# Altium schematic sheet Arria10_Ground.SchDoc: Arria 10 Ground Connections
size B; DocumentNumber: 29; SheetNumber: 29; SheetTotal: 46
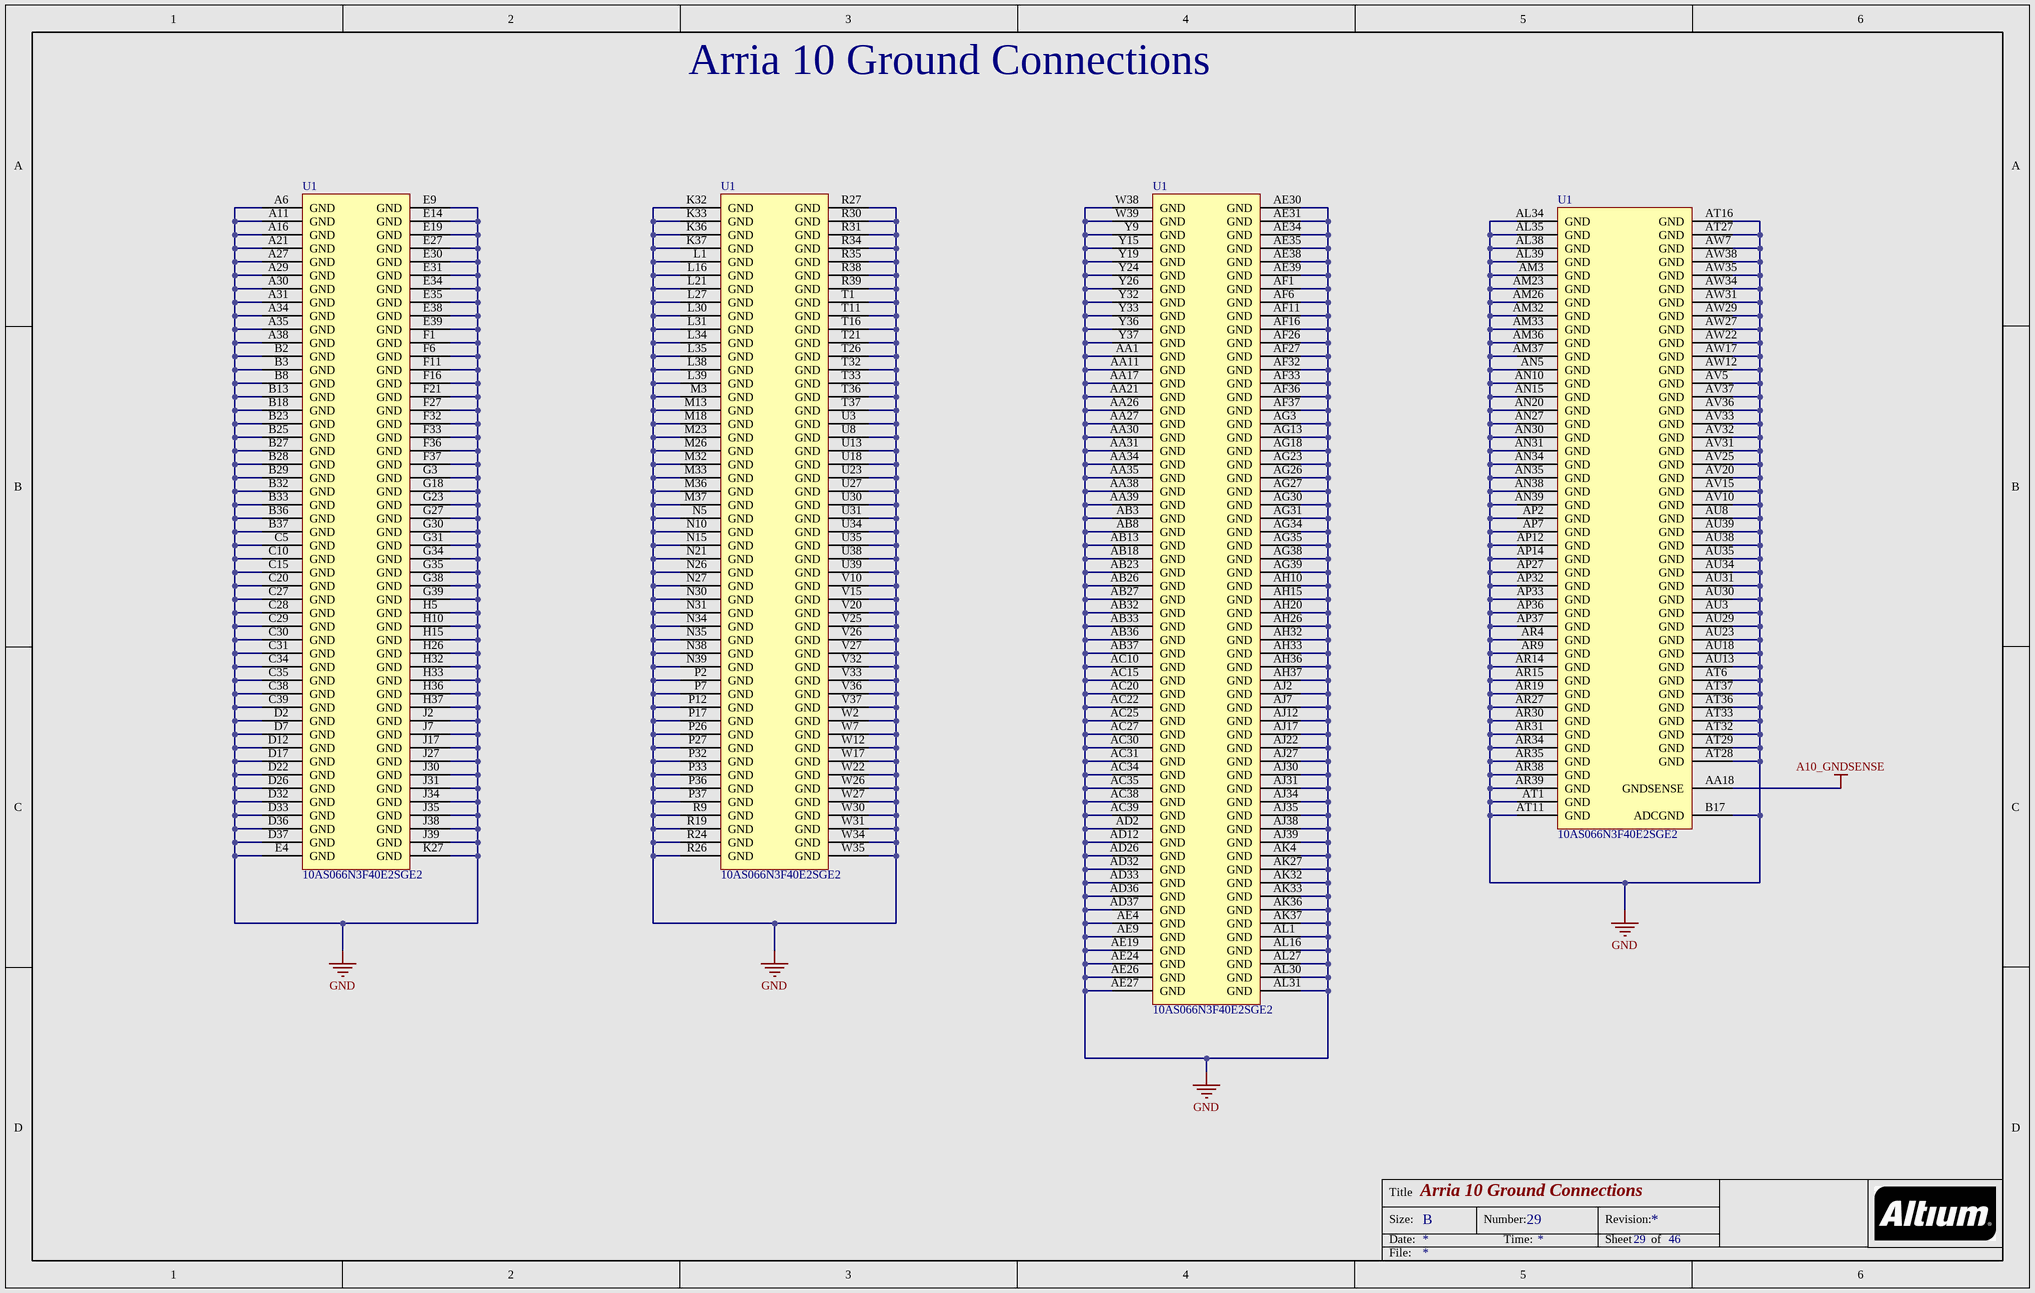
[diagram p0: Arria10_Ground.SchDoc]

## Parts
U1  10AS066N3F40E2SGE2  [ALTR-FBGA1517_A-350]  (parts 27,28,29,30 of 31)

## Nets
A10_GNDSENSE: U1.AA18(GNDSENSE)
GND: U1.A6(GND) U1.A11(GND) U1.A16(GND) U1.A21(GND) U1.A27(GND) U1.A29(GND) U1.A30(GND) U1.A31(GND) U1.A34(GND) U1.A35(GND) U1.A38(GND) U1.AA1(GND) U1.AA11(GND) U1.AA17(GND) U1.AA21(GND) U1.AA26(GND) U1.AA27(GND) U1.AA30(GND) U1.AA31(GND) U1.AA34(GND) U1.AA35(GND) U1.AA38(GND) U1.AA39(GND) U1.AB3(GND) U1.AB8(GND) U1.AB13(GND) U1.AB18(GND) U1.AB23(GND) U1.AB26(GND) U1.AB27(GND) U1.AB32(GND) U1.AB33(GND) U1.AB36(GND) U1.AB37(GND) U1.AC10(GND) U1.AC15(GND) U1.AC20(GND) U1.AC22(GND) U1.AC25(GND) U1.AC27(GND) U1.AC30(GND) U1.AC31(GND) U1.AC34(GND) U1.AC35(GND) U1.AC38(GND) U1.AC39(GND) U1.AD2(GND) U1.AD12(GND) U1.AD26(GND) U1.AD32(GND) U1.AD33(GND) U1.AD36(GND) U1.AD37(GND) U1.AE4(GND) U1.AE9(GND) U1.AE19(GND) U1.AE24(GND) U1.AE26(GND) U1.AE27(GND) U1.AE30(GND) U1.AE31(GND) U1.AE34(GND) U1.AE35(GND) U1.AE38(GND) U1.AE39(GND) U1.AF1(GND) U1.AF6(GND) U1.AF11(GND) U1.AF16(GND) U1.AF26(GND) U1.AF27(GND) U1.AF32(GND) U1.AF33(GND) U1.AF36(GND) U1.AF37(GND) U1.AG3(GND) U1.AG13(GND) U1.AG18(GND) U1.AG23(GND) U1.AG26(GND) U1.AG27(GND) U1.AG30(GND) U1.AG31(GND) U1.AG34(GND) U1.AG35(GND) U1.AG38(GND) U1.AG39(GND) U1.AH10(GND) U1.AH15(GND) U1.AH20(GND) U1.AH26(GND) U1.AH32(GND) U1.AH33(GND) U1.AH36(GND) U1.AH37(GND) U1.AJ2(GND) U1.AJ7(GND) U1.AJ12(GND) U1.AJ17(GND) U1.AJ22(GND) U1.AJ27(GND) U1.AJ30(GND) U1.AJ31(GND) U1.AJ34(GND) U1.AJ35(GND) U1.AJ38(GND) U1.AJ39(GND) U1.AK4(GND) U1.AK27(GND) U1.AK32(GND) U1.AK33(GND) U1.AK36(GND) U1.AK37(GND) U1.AL1(GND) U1.AL16(GND) U1.AL27(GND) U1.AL30(GND) U1.AL31(GND) U1.AL34(GND) U1.AL35(GND) U1.AL38(GND) U1.AL39(GND) U1.AM3(GND) U1.AM23(GND) U1.AM26(GND) U1.AM32(GND) U1.AM33(GND) U1.AM36(GND) U1.AM37(GND) U1.AN5(GND) U1.AN10(GND) U1.AN15(GND) U1.AN20(GND) U1.AN27(GND) U1.AN30(GND) U1.AN31(GND) U1.AN34(GND) U1.AN35(GND) U1.AN38(GND) U1.AN39(GND) U1.AP2(GND) U1.AP7(GND) U1.AP12(GND) U1.AP14(GND) U1.AP27(GND) U1.AP32(GND) U1.AP33(GND) U1.AP36(GND) U1.AP37(GND) U1.AR4(GND) U1.AR9(GND) U1.AR14(GND) U1.AR15(GND) U1.AR19(GND) U1.AR27(GND) U1.AR30(GND) U1.AR31(GND) U1.AR34(GND) U1.AR35(GND) U1.AR38(GND) U1.AR39(GND) U1.AT1(GND) U1.AT6(GND) U1.AT11(GND) U1.AT16(GND) U1.AT27(GND) U1.AT28(GND) U1.AT29(GND) U1.AT32(GND) U1.AT33(GND) U1.AT36(GND) U1.AT37(GND) U1.AU3(GND) U1.AU8(GND) U1.AU13(GND) U1.AU18(GND) U1.AU23(GND) U1.AU29(GND) U1.AU30(GND) U1.AU31(GND) U1.AU34(GND) U1.AU35(GND) U1.AU38(GND) U1.AU39(GND) U1.AV5(GND) U1.AV10(GND) U1.AV15(GND) U1.AV20(GND) U1.AV25(GND) U1.AV31(GND) U1.AV32(GND) U1.AV33(GND) U1.AV36(GND) U1.AV37(GND) U1.AW7(GND) U1.AW12(GND) U1.AW17(GND) U1.AW22(GND) U1.AW27(GND) U1.AW29(GND) U1.AW31(GND) U1.AW34(GND) U1.AW35(GND) U1.AW38(GND) U1.B2(GND) U1.B3(GND) U1.B8(GND) U1.B13(GND) U1.B17(ADCGND) U1.B18(GND) U1.B23(GND) U1.B25(GND) U1.B27(GND) U1.B28(GND) U1.B29(GND) U1.B32(GND) U1.B33(GND) U1.B36(GND) U1.B37(GND) U1.C5(GND) U1.C10(GND) U1.C15(GND) U1.C20(GND) U1.C27(GND) U1.C28(GND) U1.C29(GND) U1.C30(GND) U1.C31(GND) U1.C34(GND) U1.C35(GND) U1.C38(GND) U1.C39(GND) U1.D2(GND) U1.D7(GND) U1.D12(GND) U1.D17(GND) U1.D22(GND) U1.D26(GND) U1.D32(GND) U1.D33(GND) U1.D36(GND) U1.D37(GND) U1.E4(GND) U1.E9(GND) U1.E14(GND) U1.E19(GND) U1.E27(GND) U1.E30(GND) U1.E31(GND) U1.E34(GND) U1.E35(GND) U1.E38(GND) U1.E39(GND) U1.F1(GND) U1.F6(GND) U1.F11(GND) U1.F16(GND) U1.F21(GND) U1.F27(GND) U1.F32(GND) U1.F33(GND) U1.F36(GND) U1.F37(GND) U1.G3(GND) U1.G18(GND) U1.G23(GND) U1.G27(GND) U1.G30(GND) U1.G31(GND) U1.G34(GND) U1.G35(GND) U1.G38(GND) U1.G39(GND) U1.H5(GND) U1.H10(GND) U1.H15(GND) U1.H26(GND) U1.H32(GND) U1.H33(GND) U1.H36(GND) U1.H37(GND) U1.J2(GND) U1.J7(GND) U1.J17(GND) U1.J27(GND) U1.J30(GND) U1.J31(GND) U1.J34(GND) U1.J35(GND) U1.J38(GND) U1.J39(GND) U1.K27(GND) U1.K32(GND) U1.K33(GND) U1.K36(GND) U1.K37(GND) U1.L1(GND) U1.L16(GND) U1.L21(GND) U1.L27(GND) U1.L30(GND) U1.L31(GND) U1.L34(GND) U1.L35(GND) U1.L38(GND) U1.L39(GND) U1.M3(GND) U1.M13(GND) U1.M18(GND) U1.M23(GND) U1.M26(GND) U1.M32(GND) U1.M33(GND) U1.M36(GND) U1.M37(GND) U1.N5(GND) U1.N10(GND) U1.N15(GND) U1.N21(GND) U1.N26(GND) U1.N27(GND) U1.N30(GND) U1.N31(GND) U1.N34(GND) U1.N35(GND) U1.N38(GND) U1.N39(GND) U1.P2(GND) U1.P7(GND) U1.P12(GND) U1.P17(GND) U1.P26(GND) U1.P27(GND) U1.P32(GND) U1.P33(GND) U1.P36(GND) U1.P37(GND) U1.R9(GND) U1.R19(GND) U1.R24(GND) U1.R26(GND) U1.R27(GND) U1.R30(GND) U1.R31(GND) U1.R34(GND) U1.R35(GND) U1.R38(GND) U1.R39(GND) U1.T1(GND) U1.T11(GND) U1.T16(GND) U1.T21(GND) U1.T26(GND) U1.T32(GND) U1.T33(GND) U1.T36(GND) U1.T37(GND) U1.U3(GND) U1.U8(GND) U1.U13(GND) U1.U18(GND) U1.U23(GND) U1.U27(GND) U1.U30(GND) U1.U31(GND) U1.U34(GND) U1.U35(GND) U1.U38(GND) U1.U39(GND) U1.V10(GND) U1.V15(GND) U1.V20(GND) U1.V25(GND) U1.V26(GND) U1.V27(GND) U1.V32(GND) U1.V33(GND) U1.V36(GND) U1.V37(GND) U1.W2(GND) U1.W7(GND) U1.W12(GND) U1.W17(GND) U1.W22(GND) U1.W26(GND) U1.W27(GND) U1.W30(GND) U1.W31(GND) U1.W34(GND) U1.W35(GND) U1.W38(GND) U1.W39(GND) U1.Y9(GND) U1.Y15(GND) U1.Y19(GND) U1.Y24(GND) U1.Y26(GND) U1.Y32(GND) U1.Y33(GND) U1.Y36(GND) U1.Y37(GND)

## Notes on the sheet
- Title
- Size:
- Date:
- B
- Number:
- Time:
- Revision:
- Sheet
- of
- File:

## Library data of the parts
U1 = CMP-1689-00006-3: Arria 10 SX Family, 588 I/O Pins, 16 Fractional PLLs, 1517-Pin FBGA, Speed Grade 2, Extended Grade, RoHS; ComponentLink3Description: Package Specification; PackageVersion: Rev. 5.0, 01/2016; ComponentLink3URL: https://www.altera.com/content/dam/altera-www/global/en_US/pdfs/literature/packaging/04r00461-04.pdf; ComponentLink2Description: Datasheet; Code_JEDEC: MS-034; Mounting Technology: Surface Mount; PartNumber: 10AS066N3F40E2SGE2; PackageDescription: 1517-Pin FineLine Ball-Grid Array (FBGA), Body 40 x 40 mm, Pitch 1 mm; ComponentLink2URL: https://www.altera.com/content/dam/altera-www/global/en_US/pdfs/literature/hb/arria-10/a10_datasheet.pdf; ComponentLink1URL: https://www.altera.com/; DatasheetVersion: Rev. 2016-06-24, 06/2016; ComponentLink1Description: Manufacturer URL